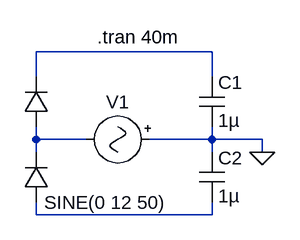
[diagram p0: schematic Doblador.asc]
Doblador.asc, the LTspice schematic file:
Version 4
SHEET 1 880 680
WIRE 544 64 320 64
WIRE 320 96 320 64
WIRE 544 96 544 64
WIRE 320 176 320 160
WIRE 384 176 320 176
WIRE 544 176 544 160
WIRE 544 176 464 176
WIRE 608 176 544 176
WIRE 320 192 320 176
WIRE 544 192 544 176
WIRE 608 192 608 176
WIRE 320 272 320 256
WIRE 544 272 544 256
WIRE 544 272 320 272
FLAG 608 192 0
SYMBOL diode 336 160 R180
WINDOW 0 24 72 Invisible 0
WINDOW 3 24 0 Invisible 0
SYMATTR InstName D1
SYMATTR Value 1N4001
SYMBOL cap 528 96 R0
SYMATTR InstName C1
SYMATTR Value 1µ
SYMATTR SpiceLine V=16 Irms=0 Rser=0.007 Lser=0 mfg="TDK" pn="C3216X7RIC105K" type="X7R"
SYMBOL cap 528 192 R0
SYMATTR InstName C2
SYMATTR Value 1µ
SYMATTR SpiceLine V=16 Irms=0 Rser=0.007 Lser=0 mfg="TDK" pn="C3216X7RIC105K" type="X7R"
SYMBOL diode 336 256 R180
WINDOW 0 24 72 Invisible 0
WINDOW 3 24 0 Invisible 0
SYMATTR InstName D2
SYMATTR Value 1N4001
SYMBOL Misc\\signal 480 176 R90
WINDOW 0 -32 56 VBottom 0
WINDOW 3 65 73 VTop 0
WINDOW 123 0 0 Left 0
WINDOW 39 0 0 Left 0
SYMATTR InstName V1
SYMATTR Value SINE(0 12 50)
TEXT 398 46 Left 0 !.tran 40m

The netlist it stands for:
* Doblador.asc
D1 N002 N001 1N4001
C1 N001 0 1µ V=16 Irms=0 Rser=0.007 Lser=0 mfg="TDK" pn="C3216X7RIC105K" type="X7R"
C2 0 N003 1µ V=16 Irms=0 Rser=0.007 Lser=0 mfg="TDK" pn="C3216X7RIC105K" type="X7R"
D2 N003 N002 1N4001
V1 0 N002 SINE(0 12 50)
.model D D
.lib standard.dio
.tran 40m
.backanno
.end